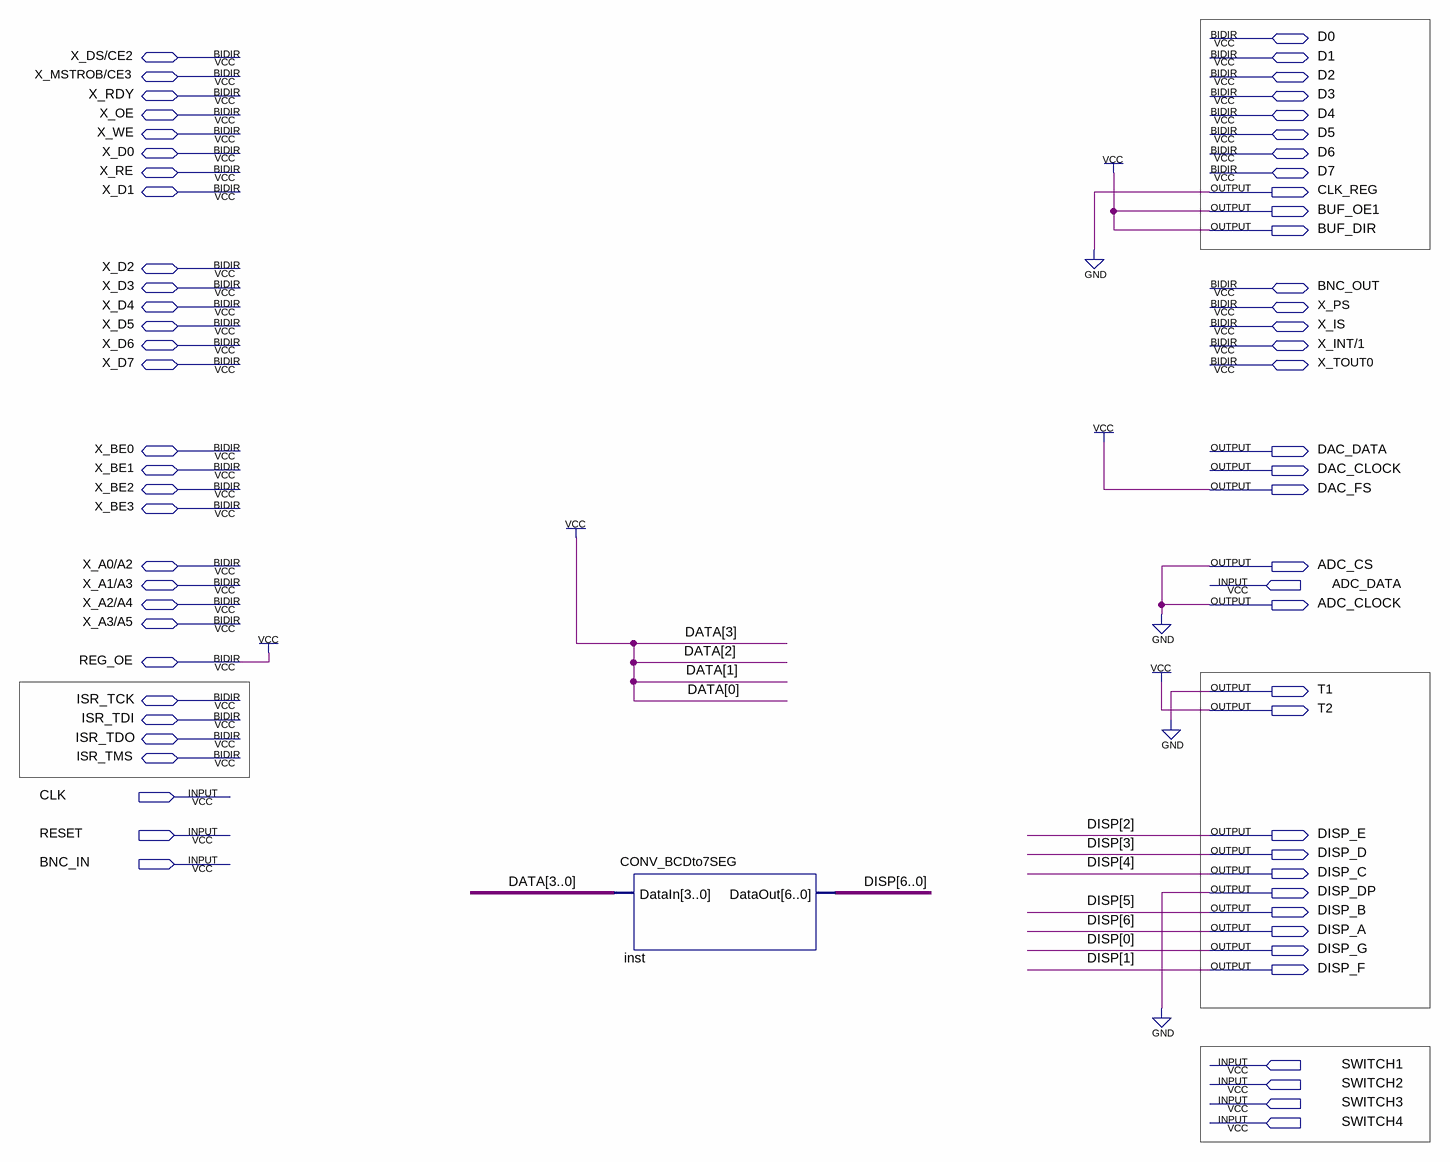
[diagram p0: schematic sheet]
// Quartus schematic MAX7128.bdf as structural Verilog: 1 symbols, 66 pins
module MAX7128 (
  input  ADC_DATA,
  input  CLK,
  input  RESET,
  input  BNC_IN,
  input  SWITCH1,
  input  SWITCH2,
  input  SWITCH3,
  input  SWITCH4,
  inout  D0,
  inout  \X_DS/CE2 ,
  inout  D1,
  inout  \X_MSTROB/CE3 ,
  inout  D2,
  inout  X_RDY,
  inout  D3,
  inout  X_OE,
  inout  D4,
  inout  X_WE,
  inout  D5,
  inout  X_D0,
  inout  D6,
  inout  X_RE,
  inout  D7,
  inout  X_D1,
  inout  X_D2,
  inout  X_D3,
  inout  BNC_OUT,
  inout  X_D4,
  inout  X_PS,
  inout  X_D5,
  inout  X_IS,
  inout  X_D6,
  inout  \X_INT/1 ,
  inout  X_D7,
  inout  X_TOUT0,
  inout  X_BE0,
  inout  X_BE1,
  inout  X_BE2,
  inout  X_BE3,
  inout  \X_A0/A2 ,
  inout  \X_A1/A3 ,
  inout  \X_A2/A4 ,
  inout  \X_A3/A5 ,
  inout  REG_OE,
  inout  ISR_TCK,
  inout  ISR_TDI,
  inout  ISR_TDO,
  inout  ISR_TMS,
  output CLK_REG,
  output BUF_OE1,
  output BUF_DIR,
  output DAC_DATA,
  output DAC_CLOCK,
  output DAC_FS,
  output ADC_CS,
  output ADC_CLOCK,
  output T1,
  output T2,
  output DISP_E,
  output DISP_D,
  output DISP_C,
  output DISP_DP,
  output DISP_B,
  output DISP_A,
  output DISP_G,
  output DISP_F
);

  CONV_BCDto7SEG inst (.DataIn(4'b1111), .DataOut({DISP_A, DISP_B, DISP_C, DISP_D, DISP_E, DISP_F, DISP_G}));

  assign ADC_CLOCK = 1'b0;
  assign ADC_CS = 1'b0;
  assign BUF_DIR = 1'b1;
  assign BUF_OE1 = 1'b1;
  assign CLK_REG = 1'b0;
  assign DAC_FS = 1'b1;
  assign DISP_DP = 1'b0;
  assign T1 = 1'b0;
  assign T2 = 1'b1;
  // also tied to VCC on the sheet: REG_OE

  // Other names for the same wires on the sheet: DISP[6:0] = {DISP_A, DISP_B, DISP_C, DISP_D, DISP_E, DISP_F, DISP_G}
endmodule
